# Altium project NVME子卡Ver0.1.PrjPcb
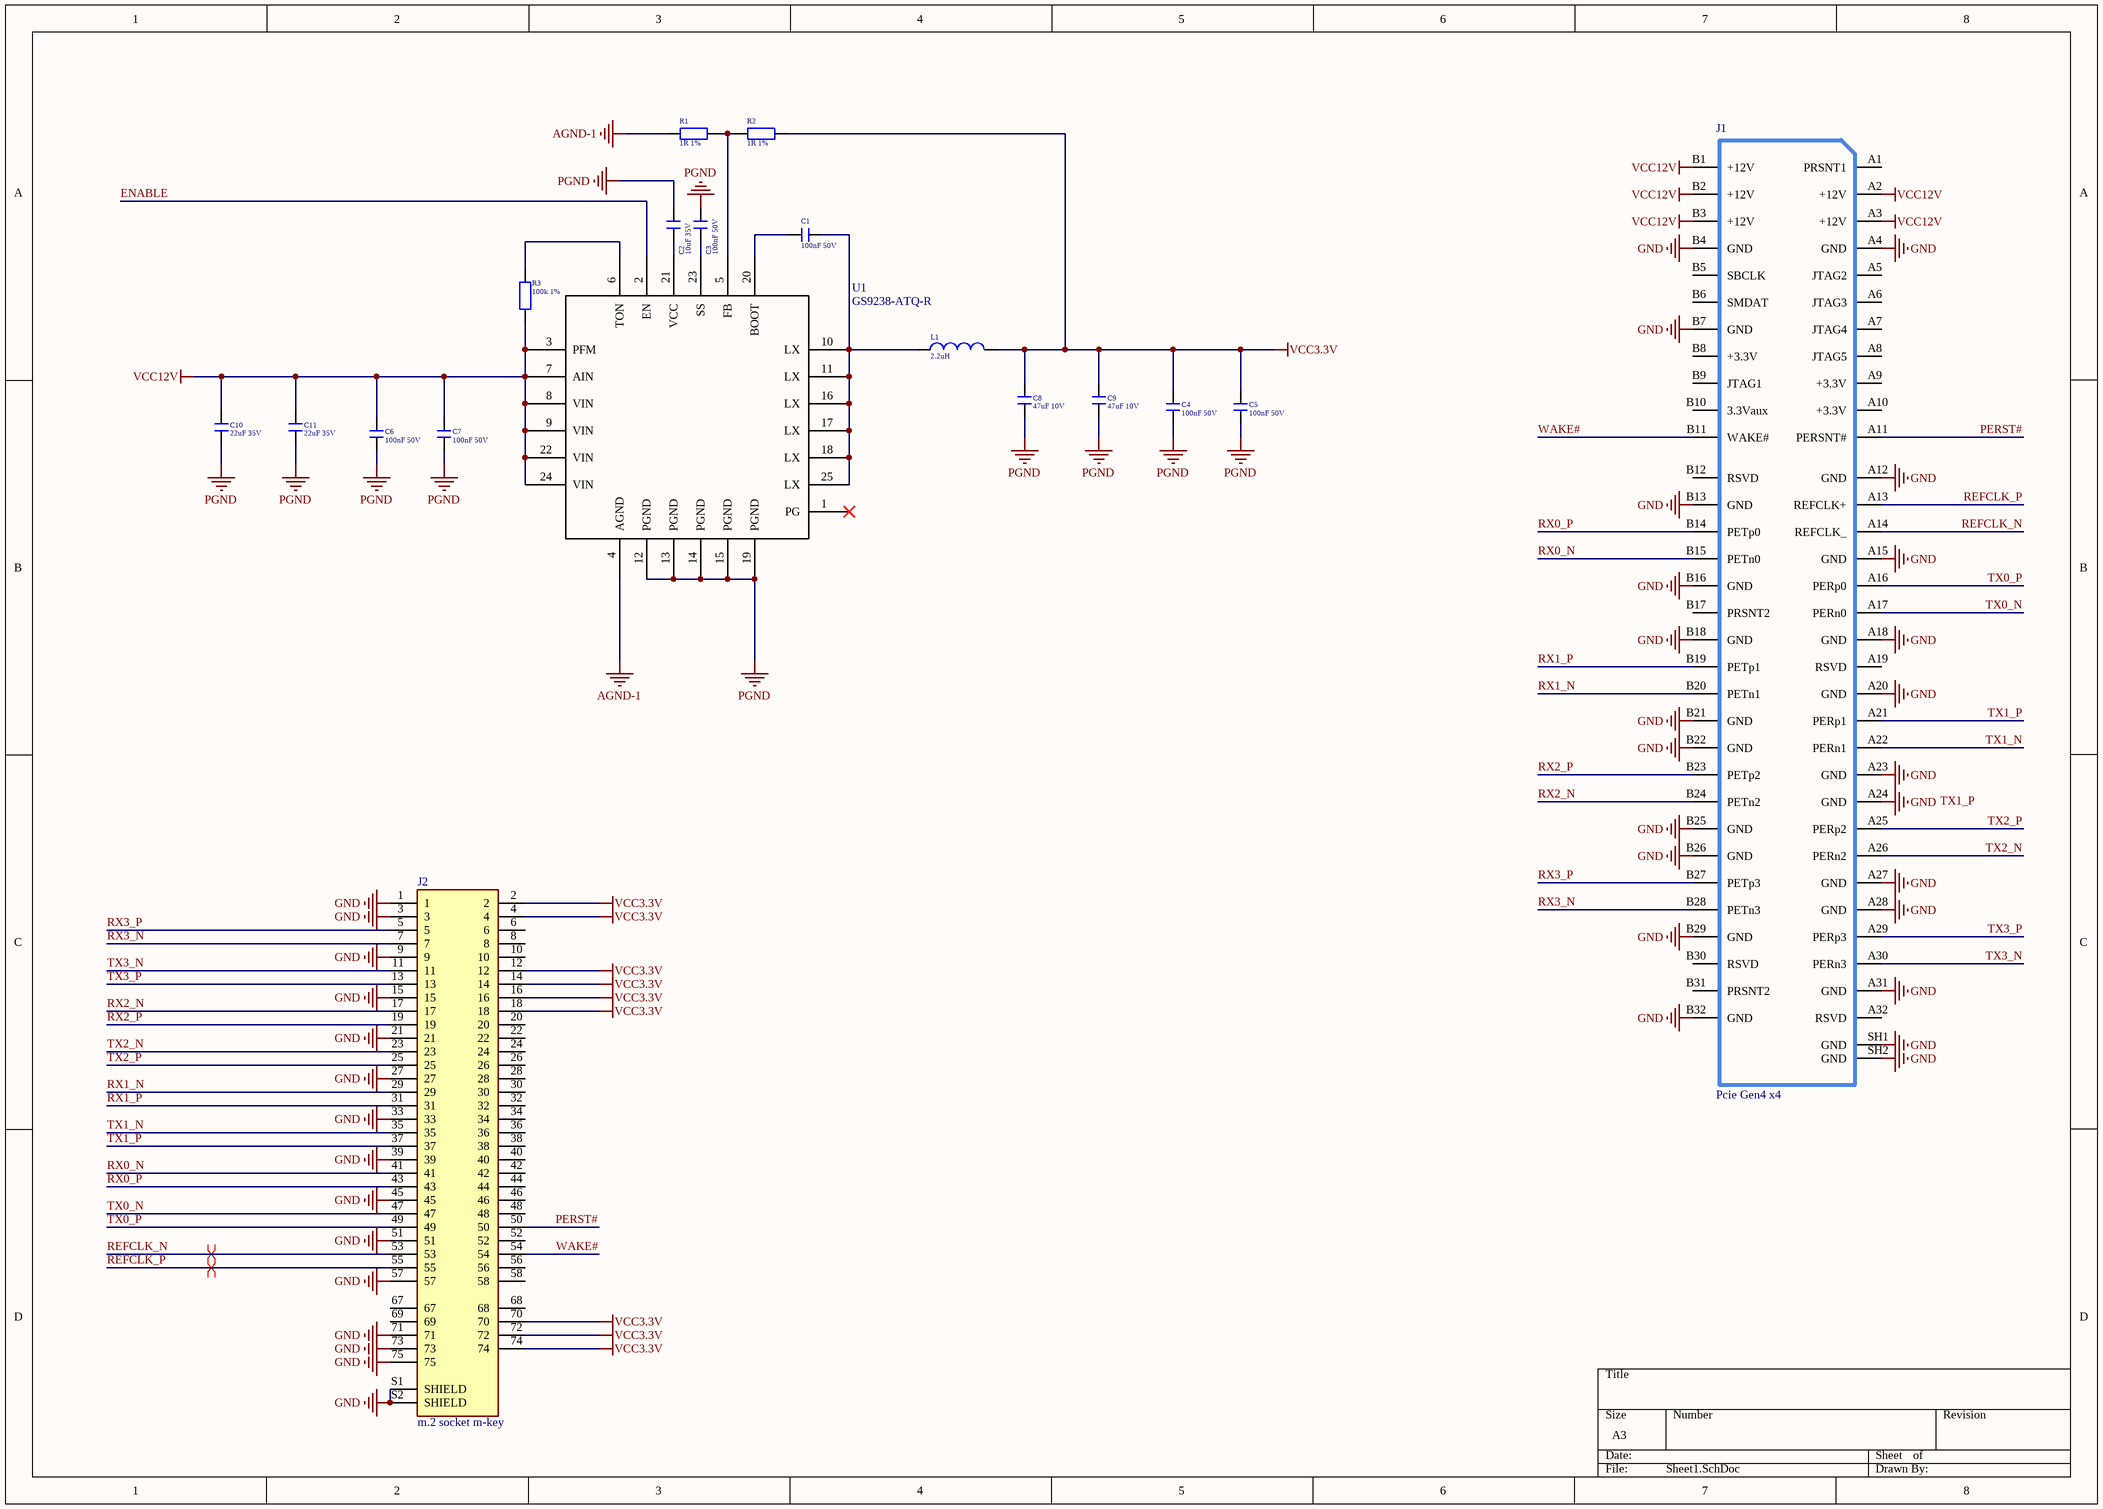
[diagram p0: Sheet1.SchDoc]
1 sheet, 18 parts. Net scope: global (net labels, ports and power ports of the same name join across sheets).
Board file: PCB.PcbDoc

## Sheet Sheet1.SchDoc
size A3; SheetNumber: 1; SheetTotal: 1

### Parts
C1  100nF 50V  [C0603_l]
C2  10uF 35V  [C0603_l]
C3  100nF 50V  [C0603_l]
C4  100nF 50V  [C0603_l]
C5  100nF 50V  [C0603_l]
C6  100nF 50V  [C0603_l]
C7  100nF 50V  [C0603_l]
C8  47uF 10V  [C1206_l]
C9  47uF 10V  [C1206_l]
C10  22uF 35V  [C1206_l]
C11  22uF 35V  [C1206_l]
J1  Pcie Gen4 x4  [PCIEDGE_X4-A]
J2  m.2 socket m-key  [M.2接口 4.2H]
L1  2.2uH  [NR6028]
R1  1R 1%  [R 0603_L]
R2  1R 1%  [R 0603_L]
R3  100k 1%  [R 0603_L]
U1  GS9238-ATQ-R  [TQFN-23_L4.0-W4.0-P0.50-BL_GS9238TQ-R]

### Nets
AGND-1: R1.1 U1.4(AGND)
GND: J1.A4(GND) J1.A12(GND) J1.A15(GND) J1.A18(GND) J1.A20(GND) J1.A23(GND) J1.A24(GND) J1.A27(GND) J1.A28(GND) J1.A31(GND) J1.B4(GND) J1.B7(GND) J1.B13(GND) J1.B16(GND) J1.B18(GND) J1.B21(GND) J1.B22(GND) J1.B25(GND) J1.B26(GND) J1.B29(GND) J1.B32(GND) J1.SH1(GND) J1.SH2(GND) J2.1 J2.3 J2.9 J2.15 J2.21 J2.27 J2.33 J2.39 J2.45 J2.51 J2.57 J2.71 J2.73 J2.75 J2.S1(SHIELD) J2.S2(SHIELD)
PGND: C2.2 C3.2 C4.1 C5.1 C6.1 C7.1 C8.1 C9.1 C10.1 C11.1 U1.12(PGND) U1.13(PGND) U1.14(PGND) U1.15(PGND) U1.19(PGND)
VCC3.3V: C4.2 C5.2 C8.2 C9.2 J2.2 J2.4 J2.12 J2.14 J2.16 J2.18 J2.70 J2.72 J2.74 L1.1 R2.2
VCC12V: C6.2 C7.2 C10.2 C11.2 J1.A2(+12V) J1.A3(+12V) J1.B1(+12V) J1.B2(+12V) J1.B3(+12V) R3.1 U1.3(PFM) U1.7(AIN) U1.8(VIN) U1.9(VIN) U1.22(VIN) U1.24(VIN)
ENABLE: U1.2(EN)
PERST#: J1.A11(PERSNT#) J2.50
REFCLK_N: J1.A14(REFCLK_) J2.53
REFCLK_P: J1.A13(REFCLK+) J2.55
RX0_N: J1.B15(PETn0) J2.41
RX0_P: J1.B14(PETp0) J2.43
RX1_N: J1.B20(PETn1) J2.29
RX1_P: J1.B19(PETp1) J2.31
RX2_N: J1.B24(PETn2) J2.17
RX2_P: J1.B23(PETp2) J2.19
RX3_N: J1.B28(PETn3) J2.7
RX3_P: J1.B27(PETp3) J2.5
TX0_N: J1.A17(PERn0) J2.47
TX0_P: J1.A16(PERp0) J2.49
TX1_N: J1.A22(PERn1) J2.35
TX1_P: J1.A21(PERp1) J2.37
TX2_N: J1.A26(PERn2) J2.23
TX2_P: J1.A25(PERp2) J2.25
TX3_N: J1.A30(PERn3) J2.11
TX3_P: J1.A29(PERp3) J2.13
WAKE#: J1.B11(WAKE#) J2.54
NetC1_1: C1.1 L1.2 U1.10(LX) U1.11(LX) U1.16(LX) U1.17(LX) U1.18(LX) U1.25(LX)
NetC1_2: C1.2 U1.20(BOOT)
NetC2_1: C2.1 U1.21(VCC)
NetC3_1: C3.1 U1.23(SS)
NetR1_2: R1.2 R2.1 U1.5(FB)
NetR3_2: R3.2 U1.6(TON)

Not connected (* = marked no-connect by the designer): J1 A1(PRSNT1) A5(JTAG2) A6(JTAG3) A7(JTAG4) A8(JTAG5) A9(+3.3V) A10(+3.3V) A19(RSVD) A32(RSVD) B5(SBCLK) B6(SMDAT) B8(+3.3V) B9(JTAG1) B10(3.3Vaux) B12(RSVD) B17(PRSNT2) B30(RSVD) B31(PRSNT2); J2 6 8 10 20 22 24 26 28 30 32 34 36 38 40 42 44 46 48 52 56 58 67 68 69; U1 1(PG)*

### Layout directives
differential pair: REFCLK_N, REFCLK_P

### Notes on the sheet
- Labels drawn without touching a wire or pin: TX1_P

### Library data of the parts
C1-C11 = C: 无极性贴片电容; 版权归属: 源创客; 材质: X7R; BOM名称: 无极性贴片电容; 学习资源: www.ooocke.com
J2 = M.2接口: MF: Amphenol ICC (FCI); MP: MDT420M01002; Package: None; Price: None; Value: *; Availability: Unavailable
L1 = L: 小功率贴片电感; 版权归属: 源创客; BOM名称: 小功率贴片电感; 学习资源: www.ooocke.com
R1-R3 = R: 贴片电阻; 版权归属: 源创客; BOM名称: 贴片电阻; 学习资源: www.ooocke.com
U1 = GS9238-ATQ-R: DCDC降压芯片